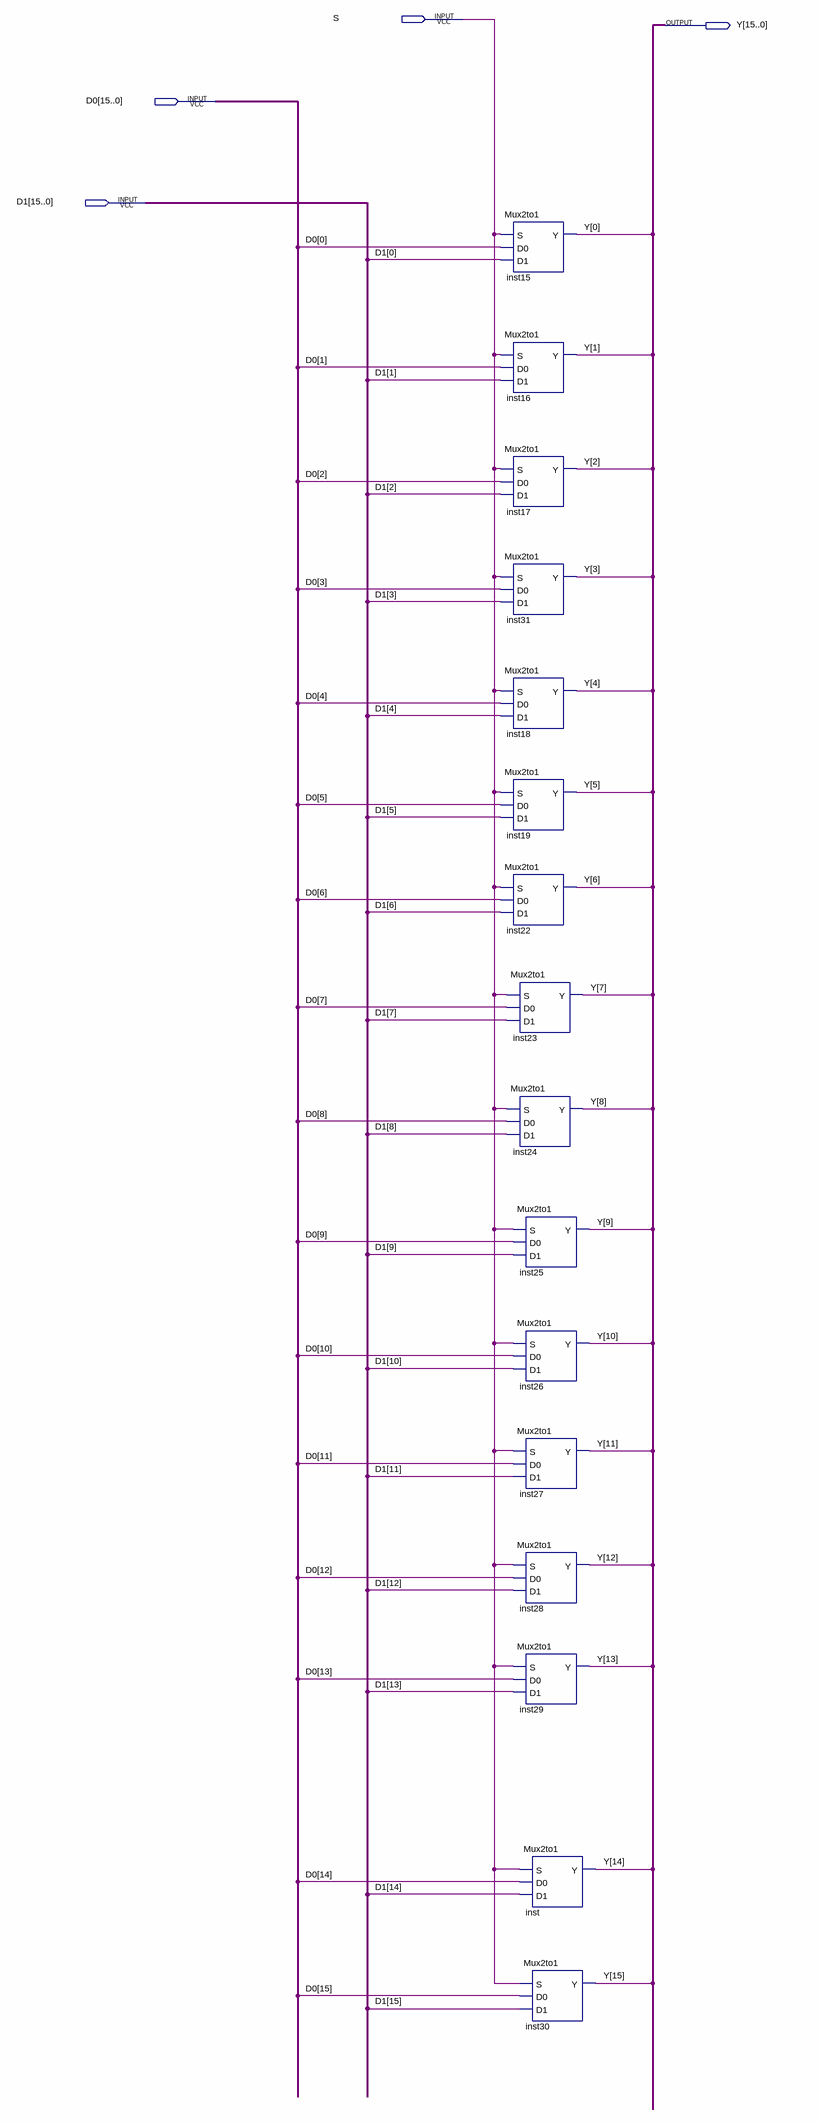
[diagram p0: schematic sheet]
// Quartus schematic Mux2to1_16bit.bdf as structural Verilog: 16 symbols, 4 pins
module Mux2to1_16bit (
  input  S,
  input  [15:0] D0,
  input  [15:0] D1,
  output [15:0] Y
);

  Mux2to1 inst15 (.S(S), .D0(D0[0]), .D1(D1[0]), .Y(Y[0]));
  Mux2to1 inst16 (.S(S), .D0(D0[1]), .D1(D1[1]), .Y(Y[1]));
  Mux2to1 inst17 (.S(S), .D0(D0[2]), .D1(D1[2]), .Y(Y[2]));
  Mux2to1 inst31 (.S(S), .D0(D0[3]), .D1(D1[3]), .Y(Y[3]));
  Mux2to1 inst18 (.S(S), .D0(D0[4]), .D1(D1[4]), .Y(Y[4]));
  Mux2to1 inst19 (.S(S), .D0(D0[5]), .D1(D1[5]), .Y(Y[5]));
  Mux2to1 inst22 (.S(S), .D0(D0[6]), .D1(D1[6]), .Y(Y[6]));
  Mux2to1 inst23 (.S(S), .D0(D0[7]), .D1(D1[7]), .Y(Y[7]));
  Mux2to1 inst24 (.S(S), .D0(D0[8]), .D1(D1[8]), .Y(Y[8]));
  Mux2to1 inst25 (.S(S), .D0(D0[9]), .D1(D1[9]), .Y(Y[9]));
  Mux2to1 inst26 (.S(S), .D0(D0[10]), .D1(D1[10]), .Y(Y[10]));
  Mux2to1 inst27 (.S(S), .D0(D0[11]), .D1(D1[11]), .Y(Y[11]));
  Mux2to1 inst28 (.S(S), .D0(D0[12]), .D1(D1[12]), .Y(Y[12]));
  Mux2to1 inst29 (.S(S), .D0(D0[13]), .D1(D1[13]), .Y(Y[13]));
  Mux2to1 inst (.S(S), .D0(D0[14]), .D1(D1[14]), .Y(Y[14]));
  Mux2to1 inst30 (.S(S), .D0(D0[15]), .D1(D1[15]), .Y(Y[15]));
endmodule
